# Altium schematic sheet SPI and enables.SchDoc
size A4; DocumentNumber: 7; SheetNumber: 7; SheetTotal: 8
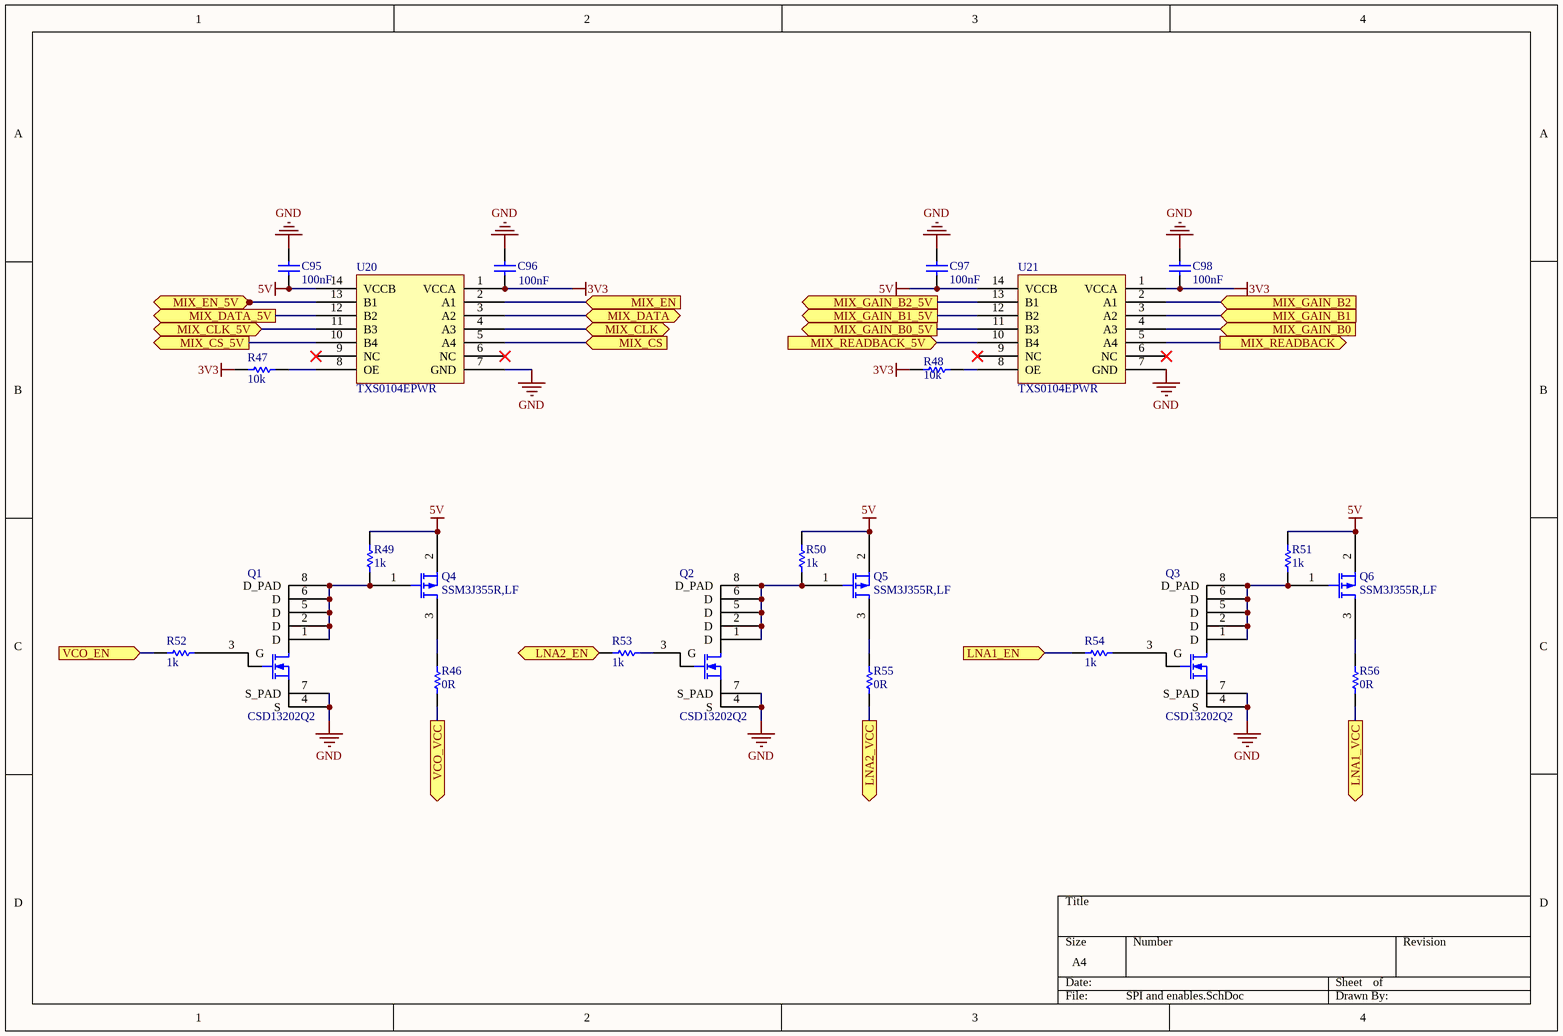
[diagram p0: SPI and enables.SchDoc]

## Parts
C95  100nF  [0603 Cap]
C96  100nF  [0603 Cap]
C97  100nF  [0603 Cap]
C98  100nF  [0603 Cap]
Q1  CSD13202Q2  [8-QFN]
Q2  CSD13202Q2  [8-QFN]
Q3  CSD13202Q2  [8-QFN]
Q4  SSM3J355R,LF  [SOT95P240X80-3M]
Q5  SSM3J355R,LF  [SOT95P240X80-3M]
Q6  SSM3J355R,LF  [SOT95P240X80-3M]
R46  0R  [0603 Res]
R47  10k  [0603 Res]
R48  10k  [0603 Res]
R49  1k  [0603 Res]
R50  1k  [0603 Res]
R51  1k  [0603 Res]
R52  1k  [0603 Res]
R53  1k  [0603 Res]
R54  1k  [0603 Res]
R55  0R  [0603 Res]
R56  0R  [0603 Res]
U20  TXS0104EPWR  [14-SOIC]
U21  TXS0104EPWR  [14-SOIC]

## Ports
LNA1_EN (in), LNA1_VCC (out), LNA2_EN (in), LNA2_VCC (out), MIX_CLK (bidir), MIX_CLK_5V (bidir), MIX_CS (in), MIX_CS_5V (out), MIX_DATA (bidir), MIX_DATA_5V (out), MIX_EN (in), MIX_EN_5V (out), MIX_GAIN_B0 (in), MIX_GAIN_B0_5V (out), MIX_GAIN_B1 (in), MIX_GAIN_B1_5V (out), MIX_GAIN_B2 (in), MIX_GAIN_B2_5V (out), MIX_READBACK (out), MIX_READBACK_5V (in), VCO_EN (in), VCO_VCC (out)

## Nets
3V3: C96.1 C98.1 R47.2 R48.2 U20.1(VCCA) U21.1(VCCA)
5V: C95.1 C97.1 Q4.2(S) Q5.2(S) Q6.2(S) R49.2 R50.2 R51.2 U20.14(VCCB) U21.14(VCCB)
GND: C95.2 C96.2 C97.2 C98.2 Q1.4(S) Q1.7(S_PAD) Q2.4(S) Q2.7(S_PAD) Q3.4(S) Q3.7(S_PAD) U20.7(GND) U21.7(GND)
LNA1_EN: R54.2 ; port LNA1_EN
LNA1_VCC: R56.1 ; port LNA1_VCC
LNA2_EN: R53.2 ; port LNA2_EN
LNA2_VCC: R55.1 ; port LNA2_VCC
MIX_CLK: U20.4(A3) ; port MIX_CLK
MIX_CLK_5V: U20.11(B3) ; port MIX_CLK_5V
MIX_CS: U20.5(A4) ; port MIX_CS
MIX_CS_5V: U20.10(B4) ; port MIX_CS_5V
MIX_DATA: U20.3(A2) ; port MIX_DATA
MIX_DATA_5V: U20.12(B2) ; port MIX_DATA_5V
MIX_EN: U20.2(A1) ; port MIX_EN
MIX_EN_5V: U20.13(B1) ; port MIX_EN_5V
MIX_GAIN_B0: U21.4(A3) ; port MIX_GAIN_B0
MIX_GAIN_B0_5V: U21.11(B3) ; port MIX_GAIN_B0_5V
MIX_GAIN_B1: U21.3(A2) ; port MIX_GAIN_B1
MIX_GAIN_B1_5V: U21.12(B2) ; port MIX_GAIN_B1_5V
MIX_GAIN_B2: U21.2(A1) ; port MIX_GAIN_B2
MIX_GAIN_B2_5V: U21.13(B1) ; port MIX_GAIN_B2_5V
MIX_READBACK: U21.5(A4) ; port MIX_READBACK
MIX_READBACK_5V: U21.10(B4) ; port MIX_READBACK_5V
VCO_EN: R52.2 ; port VCO_EN
VCO_VCC: R46.1 ; port VCO_VCC
NetQ1_1: Q1.1(D) Q1.2(D) Q1.5(D) Q1.6(D) Q1.8(D_PAD) Q4.1(G) R49.1
NetQ1_3: Q1.3(G) R52.1
NetQ2_1: Q2.1(D) Q2.2(D) Q2.5(D) Q2.6(D) Q2.8(D_PAD) Q5.1(G) R50.1
NetQ2_3: Q2.3(G) R53.1
NetQ3_1: Q3.1(D) Q3.2(D) Q3.5(D) Q3.6(D) Q3.8(D_PAD) Q6.1(G) R51.1
NetQ3_3: Q3.3(G) R54.1
NetQ4_3: Q4.3(D) R46.2
NetQ5_3: Q5.3(D) R55.2
NetQ6_3: Q6.3(D) R56.2
NetR47_1: R47.1 U20.8(OE)
NetR48_1: R48.1 U21.8(OE)

Not connected (* = marked no-connect by the designer): U20 6(NC)* 9(NC)*; U21 6(NC)* 9(NC)*

## Library data of the parts
C95-C98 = C_0603: CAP CER 16V X7R 0603; Tolerance: 10; Voltage Rating: 16; Material: Ceramic; Mount: Surface Mount; Case/Package: 0603; Case Code (Metric): 1608; Case Code (Imperial): 0603; Capacitance: *; Dielectric: X7R; Voltage Rating (DC): 16; Termination: SMD; Composition: Ceramic; Voltage: 16; Length: 1.6; Height: 0.8; Width: 0.8; Thickness: 0.035; Depth: 0.8
Q1-Q3 = CSD13202Q2: MOSFET N-CH 12V 76A 6SON; Manufacturer: Texas Instruments; FET Type: N-Channel; Current - Continuous Drain (Id) @ 25°C: 22A (Ta); Drive Voltage (Max Rds On,  Min Rds On): 2.5V, 4.5V; Rds On (Max) @ Id, Vgs: 9.3 mOhm @ 5A, 4.5V; Vgs(th) (Max) @ Id: 1.1V @ 250µA; Vgs (Max): ±8V; Power Dissipation (Max): 2.7W (Ta); Supplier 1: Digi-Key; Manufacturer Part Number: CSD13202Q2; RoHS: RoHS Compliant; Category: Discrete Semiconductor Products; Stock 1: 166239; Pricing 1: 1=0.58, 10=0.489, 100=0.3671, 500=0.26922, 1000=0.20803 (EUR); Packaging: Cut Tape (CT); Part Status: Active; Technology: MOSFET (Metal Oxide); FET Feature: -; Operating Temperature: -55°C ~ 150°C (TJ); Mounting Type: Surface Mount; Supplier Device Package: 6-WSON (2x2); Package / Case: 6-VDFN Exposed Pad; ComponentLink1URL: http://www.ti.com/lit/ds/symlink/csd13202q2.pdf; ComponentLink1Description: http://www.ti.com/lit/ds/symlink/csd13202q2.pdf; Supplier Part Number 1: 296-38911-1-ND
Q4-Q6 = SSM3J355R,LF: SMALL LOW ON RESISTANCE MOSFET; Manufacturer: Toshiba Semiconductor and Storage; FET Type: P-Channel; Current - Continuous Drain (Id) @ 25°C: 6A (Ta); Drive Voltage (Max Rds On,  Min Rds On): 1.8V, 4.5V; Rds On (Max) @ Id, Vgs: 30.1 mOhm @ 4A, 4.5V; Vgs(th) (Max) @ Id: 1V @ 1mA; Vgs (Max): ±10V; Power Dissipation (Max): 1W (Ta); Supplier 1: Digi-Key; Manufacturer Part Number: SSM3J355R,LF; RoHS: RoHS Compliant; Category: Discrete Semiconductor Products; Stock 1: 3232; Pricing 1: 1=0.43, 10=0.298, 100=0.1958, 500=0.11568, 1000=0.089 (EUR); Packaging: Cut Tape (CT); Part Status: Active; Technology: MOSFET (Metal Oxide); FET Feature: -; Operating Temperature: 150°C (TJ); Mounting Type: Surface Mount; Supplier Device Package: SOT-23F; Package / Case: SOT-23-3 Flat Leads; ComponentLink1URL: https://toshiba.semicon-storage.com/info/docget.jsp?did=55743&prodName=SSM3J355R; ComponentLink1Description: https://toshiba.semicon-storage.com/info/docget.jsp?did=55743&prodName=SSM3J355R; Supplier Part Number 1: SSM3J355RLFCT-ND
R46-R56 = R_0603: SMD Resistor, 1%, 0.1W, 0603; Tolerance: 1; Power Rating: 100; Mount: Surface Mount; Case/Package: 0603; Pins: 2; Case Code (Imperial): 0603; Case Code (Metric): 1608; Termination: SMD; Length: 1.6; Height: 0.45; Width: 0.8; Depth: 0.8
U20 U21 = TXS0104EPWR: IC TRNSLTR BIDIRECTIONAL 14TSSOP; Manufacturer: Texas Instruments; Translator Type: Voltage Level; Channels per Circuit: 4; Output Type: Open Drain, Push-Pull; Data Rate: 24Mbps; Supplier 1: Digi-Key; Manufacturer Part Number: TXS0104EPWR; RoHS: RoHS Compliant; Category: Integrated Circuits (ICs); Stock 1: 24531; Pricing 1: 1=1.15, 10=1.027, 100=0.8009, 500=0.66168, 1000=0.52237 (EUR); Packaging: Cut Tape (CT); Part Status: Active; Channel Type: Bidirectional; Input Signal: -; Output Signal: -; Operating Temperature: -40°C ~ 85°C (TA); Features: Auto-Direction Sensing; Mounting Type: Surface Mount; Package / Case: 14-TSSOP (0.173", 4.40mm Width); Supplier Device Package: 14-TSSOP; Base Part Number: TXS0104; ComponentLink1URL: http://www.ti.com/lit/ds/symlink/txs0104e.pdf; ComponentLink1Description: http://www.ti.com/lit/ds/symlink/txs0104e.pdf; Supplier Part Number 1: 296-20697-1-ND